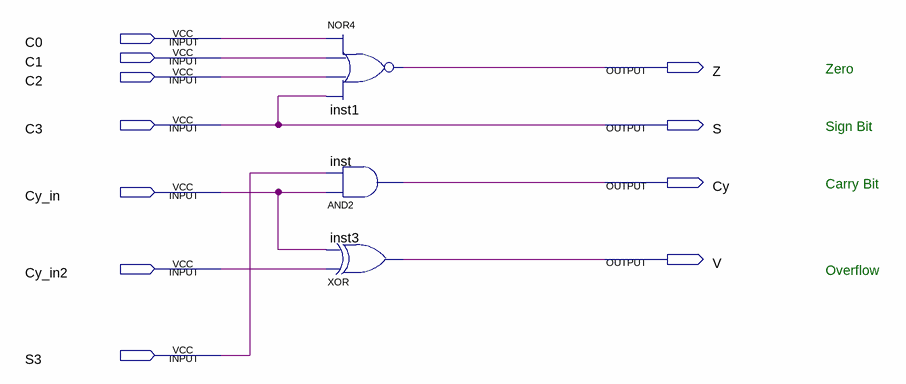
[diagram p0: schematic sheet]
// Quartus schematic ALUStatus.bdf as structural Verilog: 3 symbols, 11 pins
module ALUStatus (
  input  C0,
  input  C1,
  input  C2,
  input  C3,
  input  Cy_in,
  input  Cy_in2,
  input  S3,
  output Z,
  output S,
  output Cy,
  output V
);

  nor inst1 (Z, C0, C1, C2, C3);
  and inst (Cy, Cy_in, S3);
  xor inst3 (V, Cy_in2, Cy_in);

  assign S = C3;

  // Notes on the sheet:
  //   Zero
  //   Sign Bit
  //   Carry Bit
  //   Overflow
endmodule
